# Altium schematic sheet BMS_cells.SchDoc
size 420 x 297 mm; SheetNumber: 5; SheetTotal: 6
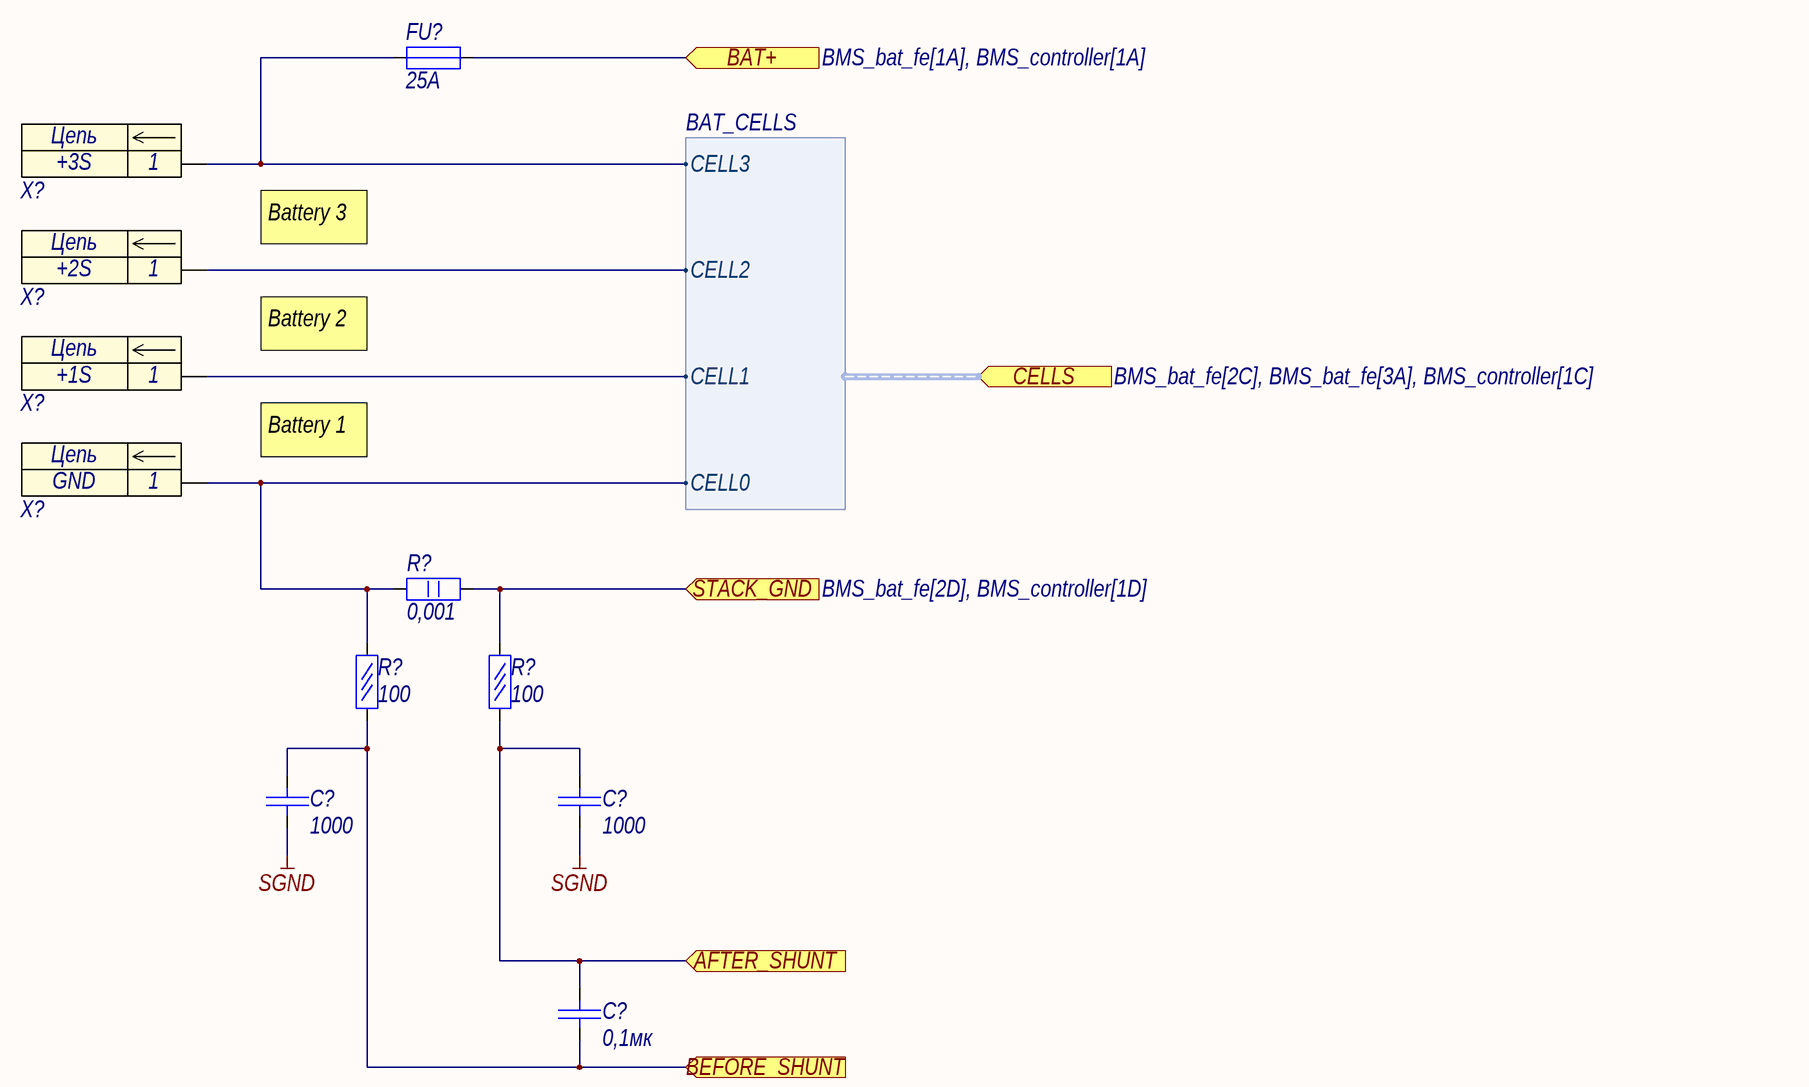
[diagram p0: BMS_cells.SchDoc]

## Parts
(Parts that share a designator on the sheet are numbered #1, #2 ... from top to bottom, then left to right.)
FU?  25A  [F1206]
R?#1  0,001  [R2512]
R?#2  100  [R0603]
R?#3  100  [R0603]
X?#1  (no value)  [PAD 10 X 5]
X?#2  (no value)  [PAD 10 X 5]
X?#3  (no value)  [PAD 10 X 5]
X?#4  (no value)  [PAD 10 X 5]
С?#1  1000  [C0603]
С?#2  1000  [C0603]
С?#3  0,1мк  [C0603]

## Ports
AFTER_SHUNT (in), BAT+ (in, see BMS_bat_fe[1A], BMS_controller[1A]), BEFORE_SHUNT (in), CELLS (in, harness BAT_CELLS, see BMS_bat_fe[2C], BMS_bat_fe[3A], BMS_controller[1C]), STACK_GND (in, see BMS_bat_fe[2D], BMS_controller[1D])

## Harnesses
BAT_CELLS: CELL0, CELL1, CELL2, CELL3

## Nets
SGND: С?#1.1 С?#2.1
AFTER_SHUNT: R?#3.1 С?#2.2 С?#3.2 ; port AFTER_SHUNT
BAT+: FU?.2 ; port BAT+
BEFORE_SHUNT: R?#2.1 С?#1.2 С?#3.1 ; port BEFORE_SHUNT
STACK_GND: R?#1.2 R?#3.2 ; port STACK_GND
NetFU?_1: FU?.1 X?#1.1 ; port CELLS.CELL3
NetR?#1_1: R?#1.1 R?#2.2 X?#4.1 ; port CELLS.CELL0
NetX?#2_1: X?#2.1 ; port CELLS.CELL2
NetX?#3_1: X?#3.1 ; port CELLS.CELL1

## Notes on the sheet
- Battery 3
- Battery 2
- Battery 1
- Подп. и дата
- Инв. № дубл.
- Взам. инв. №
- Инв. № подл.
- Лист
- Изм.
- № докум.
- Подп.
- Дата
- Копировал
- Формат
- А3
- (in symbol Contact) Цепь

## Library data of the parts
FU? = Предохранитель: Предохранитель 2Вт; Name: CC12H1.5A; Value: 25A
R?#1 = Резистор 2Вт: Value: 0,001
R?#2 R?#3 = Резистор 0.05Вт: Резистор 0,05Вт; Value: 100
X?#1 = Contact: Контакт; Contact_1: +3S
X?#2 = Contact: Контакт; Contact_1: +2S
X?#3 = Contact: Контакт; Contact_1: +1S
X?#4 = Contact: Контакт; Contact_1: GND
С?#1-С?#3 = Кер. конденсатор
  С?#1 С?#2: Value: 1000
  С?#3: Value: 0,1мк